# EAGLE schematic Analog blocks (EAGLE 6.4)
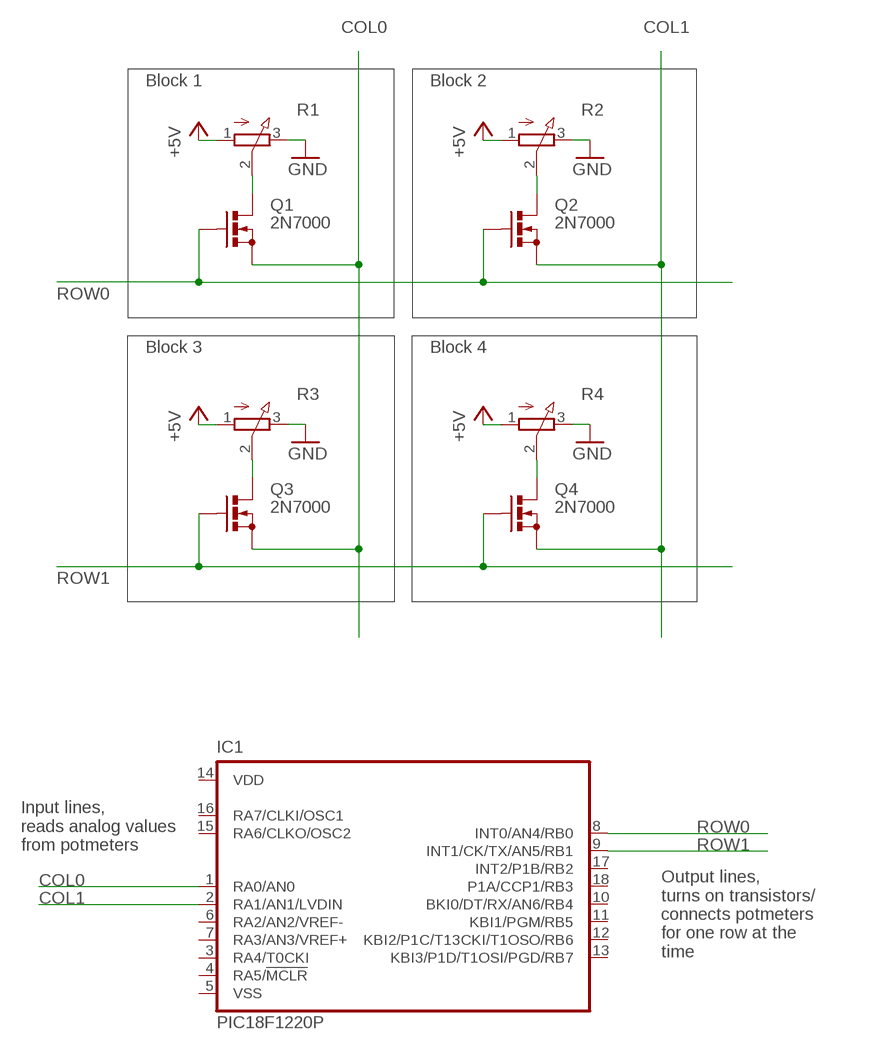
[diagram p0: schematic, sheet 1]

## Parts
IC1  PIC18F1220P  [DIL18]
Q1  2N7000  [SOT54E]
Q2  2N7000  [SOT54E]
Q3  2N7000  [SOT54E]
Q4  2N7000  [SOT54E]
R1  3RP/1610N  [3RP/1610N]
R2  3RP/1610N  [3RP/1610N]
R3  3RP/1610N  [3RP/1610N]
R4  3RP/1610N  [3RP/1610N]

## Nets
+5V: R1.1(A) R2.1(A) R3.1(A) R4.1(A)
COL0: IC1.1(RA0/AN0) Q1.D(S) Q3.D(S)
COL1: IC1.2(RA1/AN1/LVDIN) Q2.D(S) Q4.D(S)
GND: R1.3(E) R2.3(E) R3.3(E) R4.3(E)
N$1: Q1.S(D) R1.2(S)
N$2: Q2.S(D) R2.2(S)
N$3: Q4.S(D) R4.2(S)
N$4: Q3.S(D) R3.2(S)
ROW0: IC1.8(INT0/AN4/RB0) Q1.G Q2.G
ROW1: IC1.9(INT1/CK/TX/AN5/RB1) Q3.G Q4.G
Unconnected: IC1.3(RA4/T0CKI) IC1.4(RA5/!MCLR) IC1.6(RA2/AN2/VREF-) IC1.7(RA3/AN3/VREF+) IC1.10(BKI0/DT/RX/AN6/RB4) IC1.11(KBI1/PGM/RB5) IC1.12(KBI2/P1C/T13CKI/T1OSO/RB6) IC1.13(KBI3/P1D/T1OSI/PGD/RB7) IC1.15(RA6/CLKO/OSC2) IC1.16(RA7/CLKI/OSC1) IC1.17(INT2/P1B/RB2) IC1.18(P1A/CCP1/RB3)

## Notes on the sheet
- Block 1 | Block 2
- Block 3 | Block 4
- Input lines,
  reads analog values
  from potmeters
- Output lines,
  turns on transistors/
  connects potmeters
  for one row at the
  time

## Power pins joined to a net without a drawn wire
VDD: IC1.14(VDD)
VSS: IC1.5(VSS)

## Library data of the parts
IC1 = microchip:PIC18F1*20: 18/20/28-Pin High-Performance, Enhanced Flash Microcontrollers with 10-bit A/D and nanoWatt Technology Source: ww1.microchip.com/downloads/en/DeviceDoc/39605c.pdf; MF: MICROCHIP; MPN: PIC18F1220-I/P; OC_FARNELL: 9761977; OC_NEWARK: 92C2429
Q1-Q4 = joakim:2N7000: N-CHANNEL MOS FET
R1-R4 = pot:3RP/1610N: 16mm Potentiometer one level Source: http://www.alphapotentiometers.net/html/16mm_pot_2.html